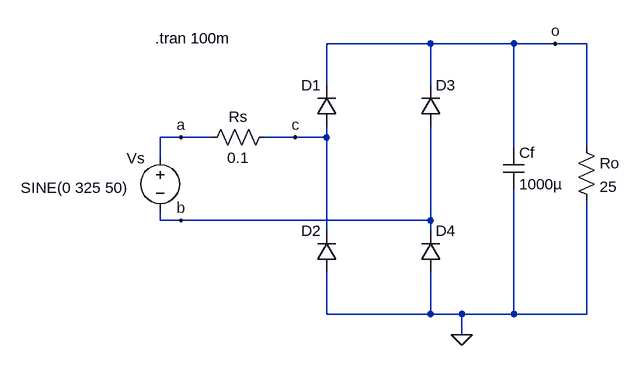
[diagram p0: schematic rectifier_cap_filter.asc]
rectifier_cap_filter.asc, the LTspice schematic file:
Version 4.1
SHEET 1 880 680
WIRE 336 -32 176 -32
WIRE 464 -32 336 -32
WIRE 528 -32 464 -32
WIRE 576 -32 528 -32
WIRE 176 32 176 -32
WIRE 336 32 336 -32
WIRE -48 112 -80 112
WIRE 0 112 -48 112
WIRE 128 112 80 112
WIRE 176 112 176 96
WIRE 176 112 128 112
WIRE 464 128 464 -32
WIRE 576 128 576 -32
WIRE -80 144 -80 112
WIRE -80 240 -80 224
WIRE -48 240 -80 240
WIRE 336 240 336 96
WIRE 336 240 -48 240
WIRE 176 256 176 112
WIRE 336 256 336 240
WIRE 176 384 176 320
WIRE 336 384 336 320
WIRE 336 384 176 384
WIRE 384 384 336 384
WIRE 464 384 464 192
WIRE 464 384 384 384
WIRE 576 384 576 208
WIRE 576 384 464 384
WIRE 384 416 384 384
FLAG 384 416 0
FLAG -48 112 a
FLAG -48 240 b
FLAG 128 112 c
FLAG 528 -32 o
SYMBOL diode 192 96 R180
WINDOW 0 24 64 Left 2
WINDOW 3 24 0 Invisible 2
SYMATTR InstName D1
SYMBOL diode 192 320 R180
WINDOW 0 24 64 Left 2
WINDOW 3 24 0 Invisible 2
SYMATTR InstName D2
SYMBOL diode 320 96 M180
WINDOW 0 24 64 Left 2
WINDOW 3 24 0 Invisible 2
SYMATTR InstName D3
SYMBOL diode 320 320 M180
WINDOW 0 24 64 Left 2
WINDOW 3 24 0 Invisible 2
SYMATTR InstName D4
SYMBOL cap 448 128 R0
SYMATTR InstName Cf
SYMATTR Value 1000µ
SYMBOL res 560 112 R0
SYMATTR InstName Ro
SYMATTR Value 25
SYMBOL res 96 96 R90
WINDOW 0 0 56 VBottom 2
WINDOW 3 32 56 VTop 2
SYMATTR InstName Rs
SYMATTR Value 0.1
SYMBOL voltage -80 128 M0
WINDOW 3 48 62 Left 2
WINDOW 123 0 0 Left 0
WINDOW 39 0 0 Left 0
SYMATTR Value SINE(0 325 50)
SYMATTR InstName Vs
TEXT -88 -40 Left 2 !.tran 100m

The netlist it stands for:
* rectifier_cap_filter.asc
D1 c o D
D2 0 c D
D3 b o D
D4 0 b D
Cf o 0 1000µ
Ro o 0 25
Rs c a 0.1
Vs a b SINE(0 325 50)
.model D D
.lib standard.dio
.tran 100m
.backanno
.end